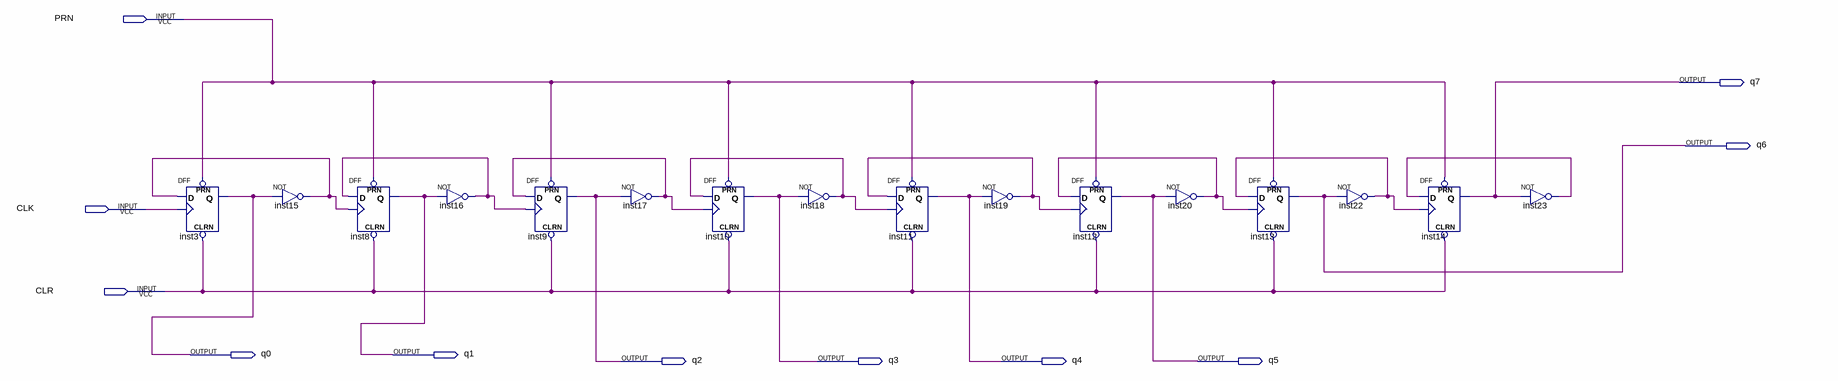
[diagram p0: schematic sheet]
// Quartus schematic counter.bdf as structural Verilog: 16 symbols, 11 pins
module counter (
  input  PRN,
  input  CLK,
  input  CLR,
  output q7,
  output q6,
  output q0,
  output q1,
  output q2,
  output q3,
  output q4,
  output q5
);

  wire inst15_out, inst16_out, inst17_out, inst18_out, inst19_out, inst20_out, inst22_out, inst23_out;

  DFF inst3 (.CLRN(CLR), .CLK(CLK), .D(inst15_out), .PRN(PRN), .Q(q0));
  not inst15 (inst15_out, q0);
  DFF inst8 (.CLRN(CLR), .CLK(inst15_out), .D(inst16_out), .PRN(PRN), .Q(q1));
  not inst16 (inst16_out, q1);
  DFF inst9 (.CLRN(CLR), .CLK(inst16_out), .D(inst17_out), .PRN(PRN), .Q(q2));
  not inst17 (inst17_out, q2);
  DFF inst10 (.CLRN(CLR), .CLK(inst17_out), .D(inst18_out), .PRN(PRN), .Q(q3));
  not inst18 (inst18_out, q3);
  DFF inst11 (.CLRN(CLR), .CLK(inst18_out), .D(inst19_out), .PRN(PRN), .Q(q4));
  not inst19 (inst19_out, q4);
  DFF inst12 (.CLRN(CLR), .CLK(inst19_out), .D(inst20_out), .PRN(PRN), .Q(q5));
  not inst20 (inst20_out, q5);
  DFF inst13 (.CLRN(CLR), .CLK(inst20_out), .D(inst22_out), .PRN(PRN), .Q(q6));
  not inst22 (inst22_out, q6);
  DFF inst14 (.CLRN(CLR), .CLK(inst22_out), .D(inst23_out), .PRN(PRN), .Q(q7));
  not inst23 (inst23_out, q7);
endmodule
